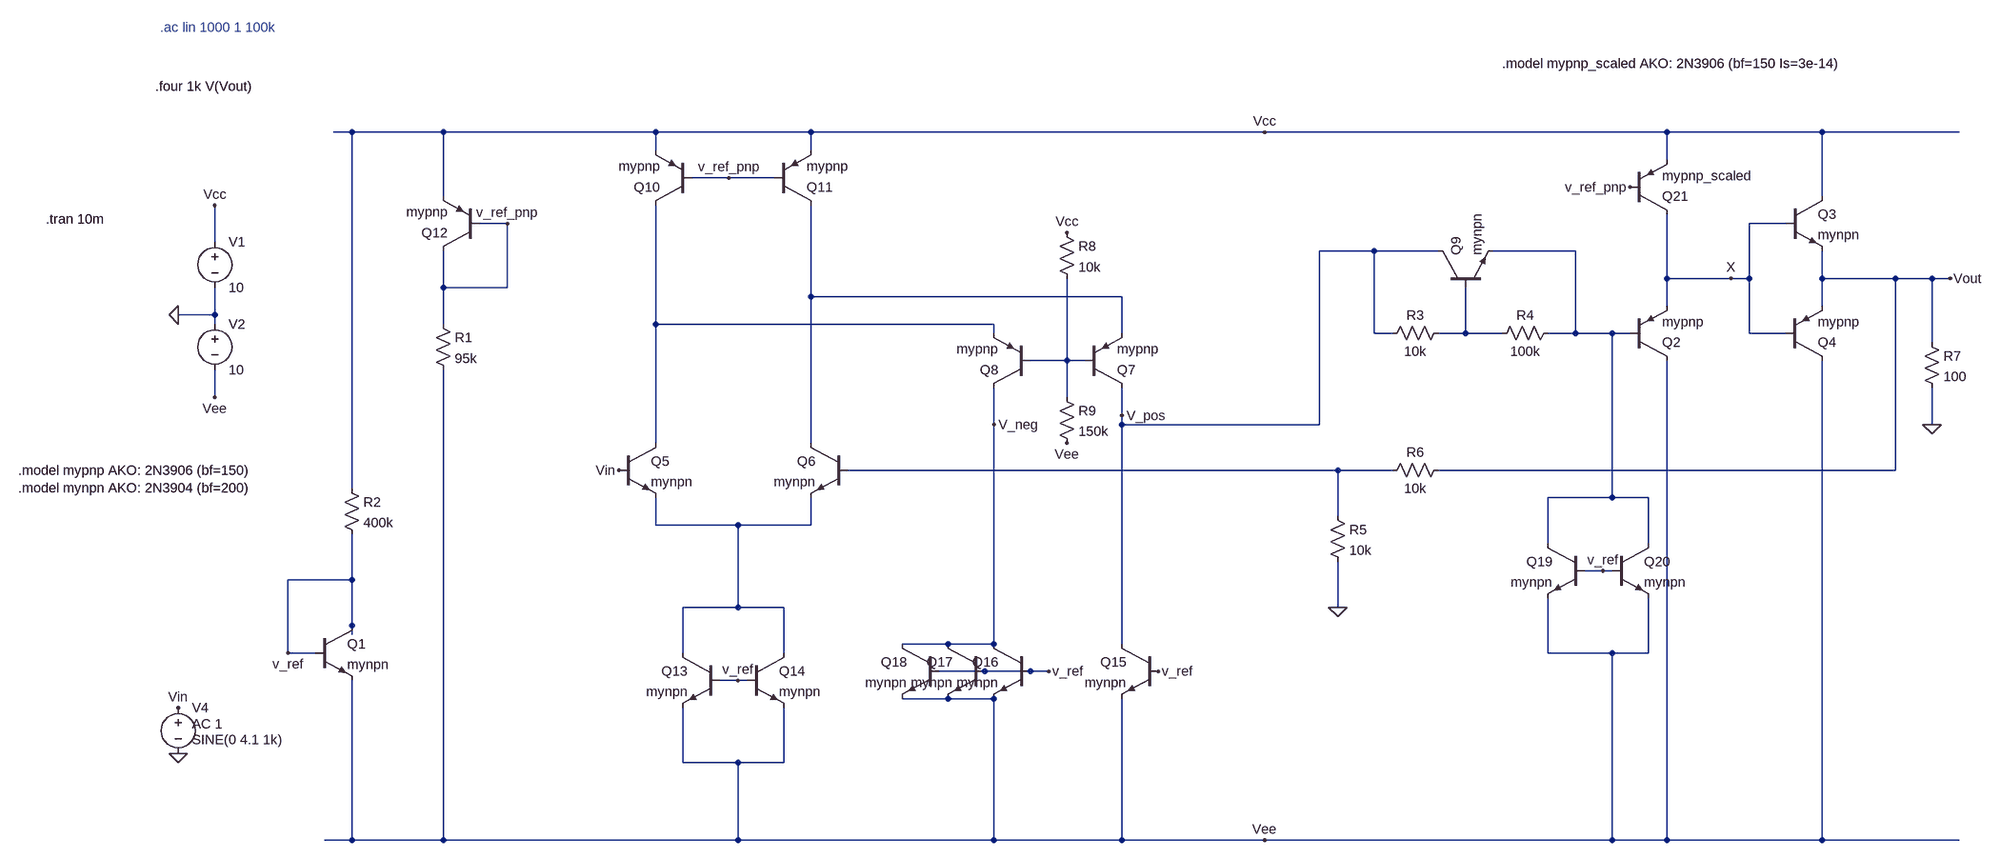
[diagram p0: schematic Designed circuit.asc]
Designed circuit.asc, the LTspice schematic file:
Version 4.1
SHEET 1 3288 1784
WIRE 160 -224 128 -224
WIRE 320 -224 160 -224
WIRE 720 -224 320 -224
WIRE 992 -224 720 -224
WIRE 2016 -224 992 -224
WIRE 2720 -224 2016 -224
WIRE 2992 -224 2720 -224
WIRE 3232 -224 2992 -224
WIRE 720 -192 720 -224
WIRE 992 -192 992 -224
WIRE 2720 -176 2720 -224
WIRE 848 -144 784 -144
WIRE 928 -144 848 -144
WIRE 320 -112 320 -224
WIRE 2992 -112 2992 -224
WIRE 432 -64 384 -64
WIRE 2928 -64 2864 -64
WIRE -80 -32 -80 -96
WIRE 2208 -16 2112 -16
WIRE 2320 -16 2208 -16
WIRE 2560 -16 2416 -16
WIRE 2720 32 2720 -80
WIRE 2832 32 2720 32
WIRE 2864 32 2864 -64
WIRE 2864 32 2832 32
WIRE 2992 32 2992 -16
WIRE 3120 32 2992 32
WIRE 3184 32 3120 32
WIRE 3216 32 3184 32
WIRE 320 48 320 -16
WIRE 432 48 432 -64
WIRE 432 48 320 48
WIRE 992 64 992 -96
WIRE 1536 64 992 64
WIRE 2720 80 2720 32
WIRE 2992 80 2992 32
WIRE -80 96 -80 48
WIRE -80 96 -144 96
WIRE -80 112 -80 96
WIRE 320 112 320 48
WIRE 720 112 720 -96
WIRE 1312 112 720 112
WIRE 1312 128 1312 112
WIRE 1536 128 1536 64
WIRE 2208 128 2208 -16
WIRE 2240 128 2208 128
WIRE 2368 128 2368 48
WIRE 2368 128 2320 128
WIRE 2432 128 2368 128
WIRE 2560 128 2560 -16
WIRE 2560 128 2512 128
WIRE 2624 128 2560 128
WIRE 2656 128 2624 128
WIRE 2864 128 2864 32
WIRE 2928 128 2864 128
WIRE 3184 144 3184 32
WIRE 1440 176 1440 32
WIRE 1440 176 1376 176
WIRE 1472 176 1440 176
WIRE -80 240 -80 192
WIRE 1440 240 1440 176
WIRE 1536 272 1536 224
WIRE 1312 288 1312 224
WIRE 1536 288 1536 272
WIRE 2112 288 2112 -16
WIRE 2112 288 1536 288
WIRE 3184 288 3184 224
WIRE 720 320 720 112
WIRE 992 320 992 64
WIRE 2144 368 1056 368
WIRE 2240 368 2144 368
WIRE 3120 368 3120 32
WIRE 3120 368 2320 368
WIRE 160 400 160 -224
WIRE 2624 416 2624 128
WIRE 2624 416 2512 416
WIRE 2688 416 2624 416
WIRE 2144 448 2144 368
WIRE 720 464 720 416
WIRE 864 464 720 464
WIRE 992 464 992 416
WIRE 992 464 864 464
WIRE 2512 496 2512 416
WIRE 2688 496 2688 416
WIRE 2608 544 2576 544
WIRE 2624 544 2608 544
WIRE 160 560 160 480
WIRE 160 560 48 560
WIRE 864 608 864 464
WIRE 864 608 768 608
WIRE 944 608 864 608
WIRE 2144 608 2144 528
WIRE 160 640 160 560
WIRE 160 656 160 640
WIRE 1232 672 1152 672
WIRE 1312 672 1312 288
WIRE 1312 672 1232 672
WIRE 1536 672 1536 288
WIRE 48 688 48 560
WIRE 96 688 48 688
WIRE 768 688 768 608
WIRE 944 688 944 608
WIRE 2512 688 2512 592
WIRE 2624 688 2512 688
WIRE 2688 688 2688 592
WIRE 2688 688 2624 688
WIRE 1296 720 1216 720
WIRE 1376 720 1296 720
WIRE 1408 720 1376 720
WIRE 864 736 832 736
WIRE 880 736 864 736
WIRE 1232 768 1152 768
WIRE 1312 768 1232 768
WIRE 768 880 768 784
WIRE 864 880 768 880
WIRE 944 880 944 784
WIRE 944 880 864 880
WIRE 160 1024 160 736
WIRE 160 1024 112 1024
WIRE 320 1024 320 192
WIRE 320 1024 160 1024
WIRE 864 1024 864 880
WIRE 864 1024 320 1024
WIRE 1312 1024 1312 768
WIRE 1312 1024 864 1024
WIRE 1536 1024 1536 768
WIRE 1536 1024 1312 1024
WIRE 2016 1024 1536 1024
WIRE 2624 1024 2624 688
WIRE 2624 1024 2016 1024
WIRE 2720 1024 2720 176
WIRE 2720 1024 2624 1024
WIRE 2992 1024 2992 176
WIRE 2992 1024 2720 1024
WIRE 3232 1024 2992 1024
FLAG -80 -96 Vcc
FLAG -80 240 Vee
FLAG -144 96 0
FLAG -144 864 0
FLAG -144 784 Vin
FLAG 2016 1024 Vee
FLAG 2016 -224 Vcc
FLAG 1536 272 V_pos
FLAG 1312 288 V_neg
FLAG 2144 608 0
FLAG 3184 288 0
FLAG 3216 32 Vout
FLAG 2832 32 X
FLAG 656 368 Vin
FLAG 48 688 v_ref
FLAG 864 736 v_ref
FLAG 432 -64 v_ref_pnp
FLAG 848 -144 v_ref_pnp
FLAG 1600 720 v_ref
FLAG 1408 720 v_ref
FLAG 2608 544 v_ref
FLAG 2656 -128 v_ref_pnp
FLAG 1440 -48 Vcc
FLAG 1440 320 Vee
SYMBOL voltage -80 -48 R0
SYMATTR InstName V1
SYMATTR Value 10
SYMBOL voltage -80 96 R0
SYMATTR InstName V2
SYMATTR Value 10
SYMBOL voltage -144 768 R0
WINDOW 123 24 44 Left 2
WINDOW 39 0 0 Left 0
WINDOW 3 24 72 Left 2
SYMATTR Value2 AC 1
SYMATTR Value SINE(0 4.1 1k)
SYMATTR InstName V4
SYMBOL npn 656 320 R0
SYMATTR InstName Q5
SYMATTR Value mynpn
SYMBOL npn 1056 320 M0
SYMATTR InstName Q6
SYMATTR Value mynpn
SYMBOL pnp 1472 224 M180
SYMATTR InstName Q7
SYMATTR Value mypnp
SYMBOL pnp 1376 224 R180
SYMATTR InstName Q8
SYMATTR Value mypnp
SYMBOL npn 96 640 R0
SYMATTR InstName Q1
SYMATTR Value mynpn
SYMBOL res 144 384 R0
SYMATTR InstName R2
SYMATTR Value 400k
SYMBOL res 2336 112 R90
WINDOW 0 0 56 VBottom 2
WINDOW 3 32 56 VTop 2
SYMATTR InstName R3
SYMATTR Value 10k
SYMBOL res 2528 112 R90
WINDOW 0 0 56 VBottom 2
WINDOW 3 32 56 VTop 2
SYMATTR InstName R4
SYMATTR Value 100k
SYMBOL res 2128 432 R0
SYMATTR InstName R5
SYMATTR Value 10k
SYMBOL res 2336 352 R90
WINDOW 0 0 56 VBottom 2
WINDOW 3 32 56 VTop 2
SYMATTR InstName R6
SYMATTR Value 10k
SYMBOL pnp 2656 176 M180
SYMATTR InstName Q2
SYMATTR Value mypnp
SYMBOL npn 2928 -112 R0
SYMATTR InstName Q3
SYMATTR Value mynpn
SYMBOL pnp 2928 176 M180
SYMATTR InstName Q4
SYMATTR Value mypnp
SYMBOL res 3168 128 R0
SYMATTR InstName R7
SYMATTR Value 100
SYMBOL npn 2320 48 R270
SYMATTR InstName Q9
SYMATTR Value mynpn
SYMBOL pnp 784 -96 R180
SYMATTR InstName Q10
SYMATTR Value mypnp
SYMBOL pnp 928 -96 M180
SYMATTR InstName Q11
SYMATTR Value mypnp
SYMBOL pnp 384 -16 R180
SYMATTR InstName Q12
SYMATTR Value mypnp
SYMBOL res 304 96 R0
SYMATTR InstName R1
SYMATTR Value 95k
SYMBOL npn 832 688 M0
SYMATTR InstName Q13
SYMATTR Value mynpn
SYMBOL npn 880 688 R0
SYMATTR InstName Q14
SYMATTR Value mynpn
SYMBOL npn 1600 672 M0
SYMATTR InstName Q15
SYMATTR Value mynpn
SYMBOL npn 1376 672 M0
SYMATTR InstName Q16
SYMATTR Value mynpn
SYMBOL npn 1296 672 M0
SYMATTR InstName Q17
SYMATTR Value mynpn
SYMBOL npn 1216 672 M0
SYMATTR InstName Q18
SYMATTR Value mynpn
SYMBOL npn 2576 496 M0
SYMATTR InstName Q19
SYMATTR Value mynpn
SYMBOL npn 2624 496 R0
SYMATTR InstName Q20
SYMATTR Value mynpn
SYMBOL pnp 2656 -80 M180
SYMATTR InstName Q21
SYMATTR Value mypnp_scaled
SYMBOL res 1424 -64 R0
SYMATTR InstName R8
SYMATTR Value 10k
SYMBOL res 1424 224 R0
SYMATTR InstName R9
SYMATTR Value 150k
TEXT -424 368 Left 2 !.model mypnp AKO: 2N3906 (bf=150)\n.model mynpn AKO: 2N3904 (bf=200)
TEXT -376 -72 Left 2 !.tran 10m
TEXT 2432 -344 Left 2 !.model mypnp_scaled AKO: 2N3906 (bf=150 Is=3e-14)
TEXT -184 -304 Left 2 !.four 1k V(Vout)
TEXT -176 -408 Left 2 ;.ac lin 1000 1 100k

The netlist it stands for:
* Designed circuit.asc
V1 Vcc 0 10
V2 0 Vee 10
V4 Vin 0 SINE(0 4.1 1k) AC 1
Q5 N003 Vin N007 0 mynpn
Q6 N002 N006 N007 0 mynpn
Q7 V_pos N005 N002 0 mypnp
Q8 V_neg N005 N003 0 mypnp
Q1 v_ref v_ref Vee 0 mynpn
R2 Vcc v_ref 400k
R3 N004 V_pos 10k
R4 N001 N004 100k
R5 N006 0 10k
R6 Vout N006 10k
Q2 Vee N001 X 0 mypnp
Q3 Vcc X Vout 0 mynpn
Q4 Vee X Vout 0 mypnp
R7 Vout 0 100
Q9 V_pos N004 N001 0 mynpn
Q10 N003 v_ref_pnp Vcc 0 mypnp
Q11 N002 v_ref_pnp Vcc 0 mypnp
Q12 v_ref_pnp v_ref_pnp Vcc 0 mypnp
R1 v_ref_pnp Vee 95k
Q13 N007 v_ref Vee 0 mynpn
Q14 N007 v_ref Vee 0 mynpn
Q15 V_pos v_ref Vee 0 mynpn
Q16 V_neg v_ref Vee 0 mynpn
Q17 V_neg v_ref Vee 0 mynpn
Q18 V_neg v_ref Vee 0 mynpn
Q19 N001 v_ref Vee 0 mynpn
Q20 N001 v_ref Vee 0 mynpn
Q21 X v_ref_pnp Vcc 0 mypnp_scaled
R8 Vcc N005 10k
R9 N005 Vee 150k
.model NPN NPN
.model PNP PNP
.lib standard.bjt
.model mypnp AKO: 2N3906 (bf=150)
.model mynpn AKO: 2N3904 (bf=200)
.tran 10m
.model mypnp_scaled AKO: 2N3906 (bf=150 Is=3e-14)
.four 1k V(Vout)
* .ac lin 1000 1 100k
.backanno
.end